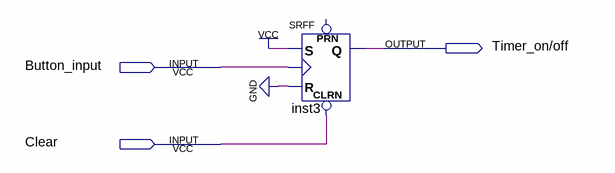
[diagram p0: schematic sheet]
// Quartus schematic Start_end_check.bdf as structural Verilog: 1 symbols, 3 pins
module Start_end_check (
  input  Button_input,
  input  Clear,
  output \Timer_on/off 
);

  SRFF inst3 (.CLRN(Clear), .S(1'b1), .R(1'b0), .CLK(Button_input), .Q(\Timer_on/off ));  // open: PRN
endmodule
